# EasyEDA schematic 1-Schematic_passcipher.json

## Sheets
1 Sheet_1
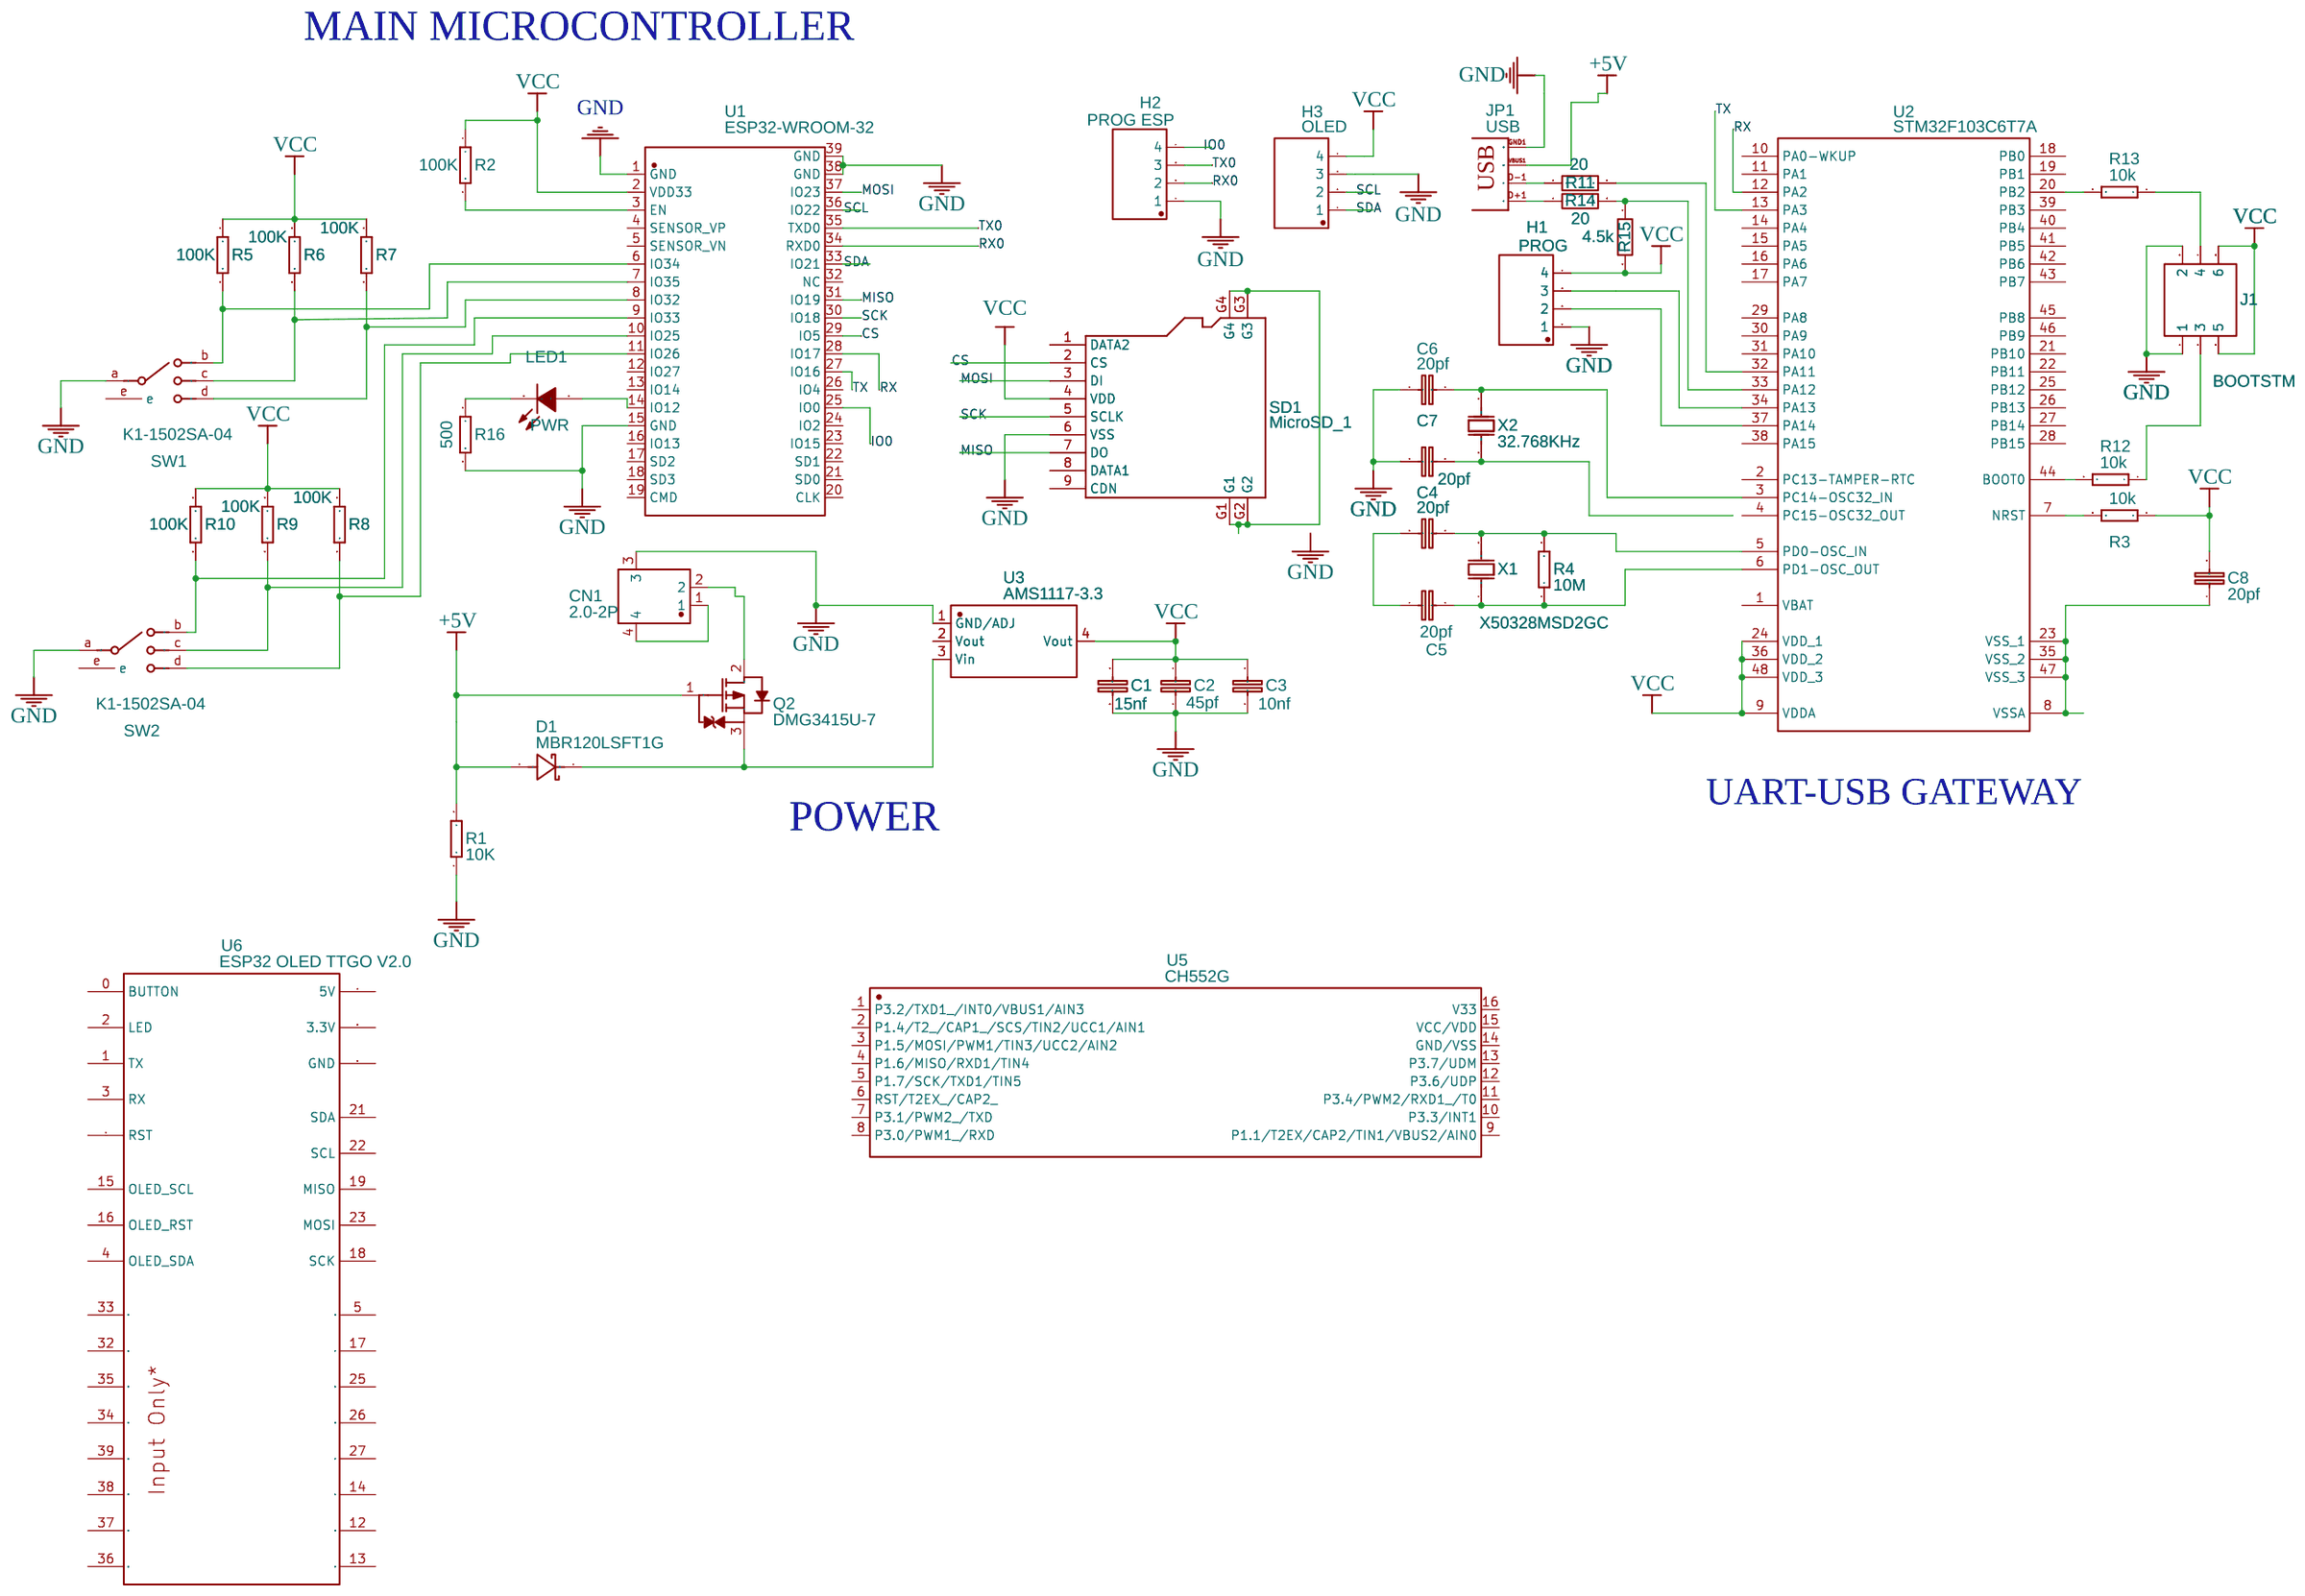
[diagram p0: Sheet_1]
2 expansionboard: TITLE: Sheet_3; REV: 1.0; Date: 2021-07-15; Sheet: 1/1; Drawn By: Taiwo Yusuf Hassan; Company: Your Company
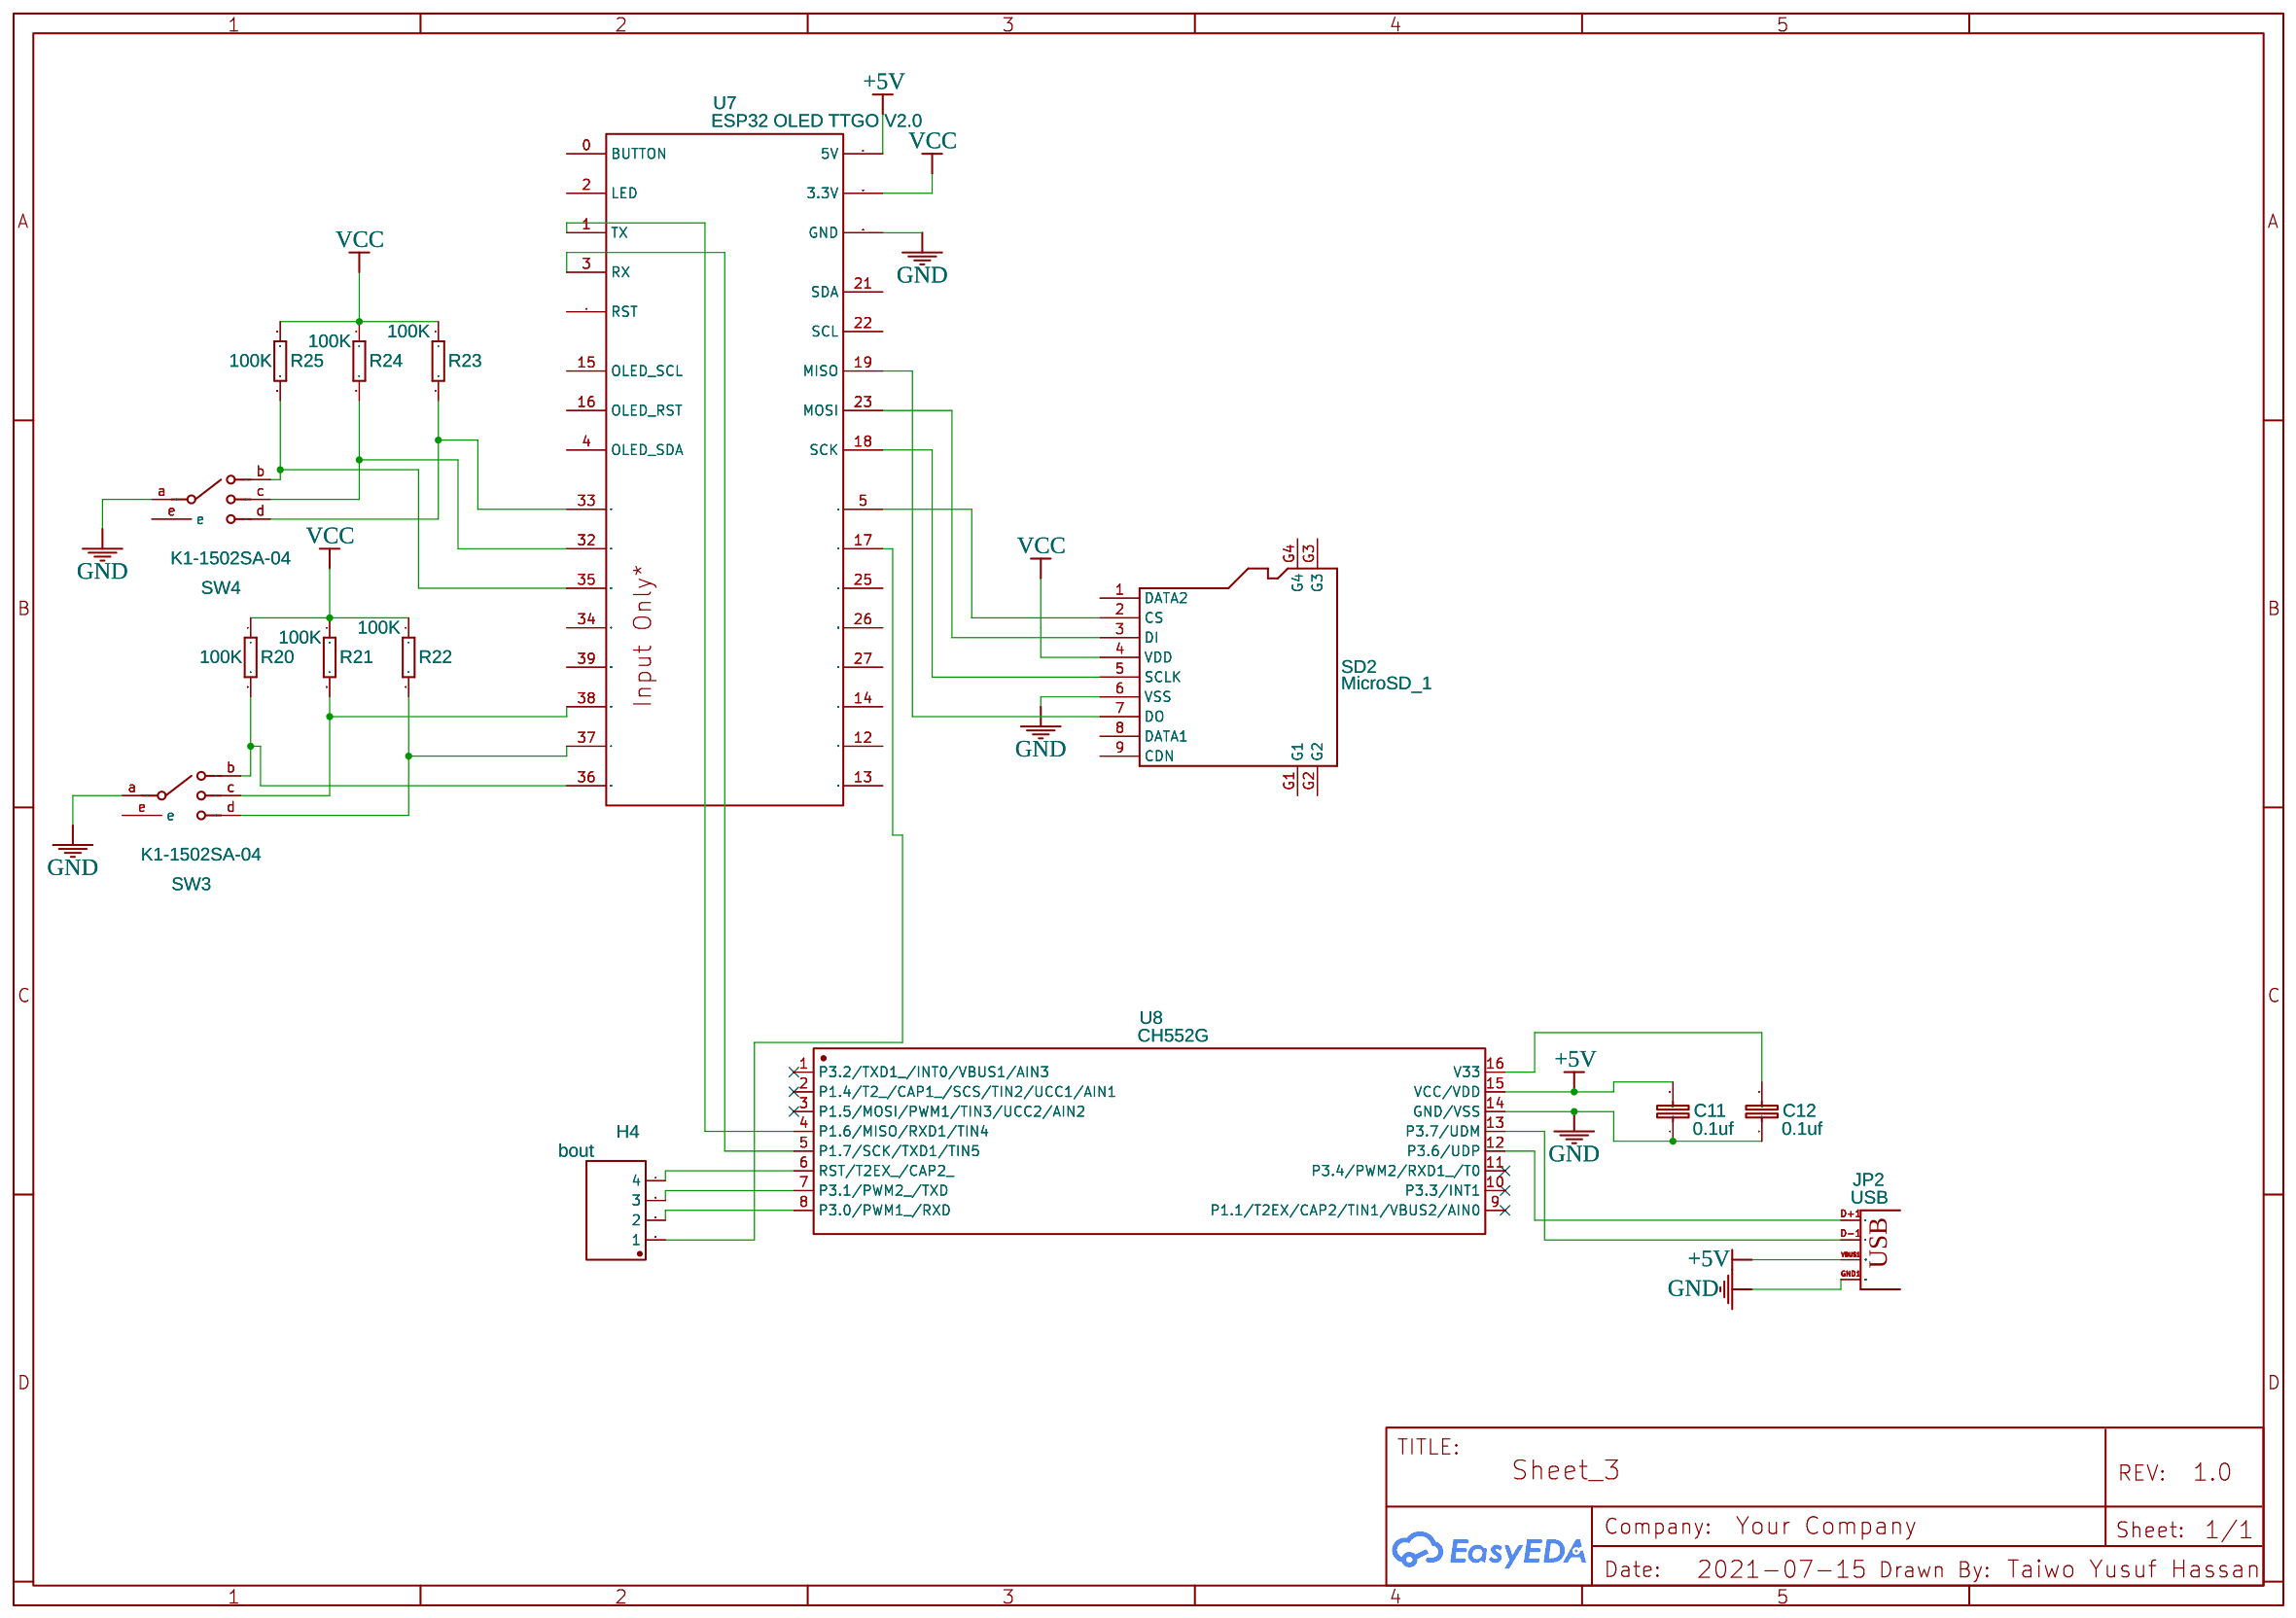
[diagram p1: expansionboard]

## Parts
sheet expansionboard
C11  0.1uf  [C603]
C12  0.1uf  [C603]
H4  bout  [HDR-TH_4P-P2.54-V]
JP2  USB  [USB-A-SMT-MALE]
R20  100K  [R805]
R21  100K  [R805]
R22  100K  [R805]
R23  100K  [R805]
R24  100K  [R805]
R25  100K  [R805]
SD2  MicroSD_1  [MICRO-SD9+4P-SMD-16.1X14.5X1.85MM]
SW3  K1-1502SA-04  [SW-SMD_K1-1502SA-04]
SW4  K1-1502SA-04  [SW-SMD_K1-1502SA-04]
U7  ESP32 OLED TTGO V2.0  [ESP32 OLED TTGO V2.0 PRO]
U8  CH552G  [SOP-16_L10.0-W3.9-P1.27-LS6.0-BL]
sheet Sheet_1
C1  15nf  [C603]
C2  45pf  [C603]
C3  10nf  [C603]
C4  20pf  [C603]
C5  20pf  [C603]
C6  20pf  [C603]
C7  20pf  [C603]
C8  20pf  [C603]
CN1  2.0-2P  [CONN-SMD_2.0-2P-LT]
D1  MBR120LSFT1G  [SOD-123_L2.8-W1.8-LS3.7-RD]
H1  PROG  [HDR-TH_4P-P2.54-V]
H2  PROG ESP  [HDR-TH_4P-P2.54-V]
H3  OLED  [HDR-TH_4P-P2.54-V]
J1  BOOTSTM  [HDR-TH_6P-P2.54-V-R2-C3-S2.54]
JP1  USB  [USB-A-SMT-MALE]
LED1  PWR  [LED0603-R-RD]
Q2  DMG3415U-7  [SOT-23-3_L2.9-W1.6-P1.90-LS2.8-BR-CW]
R1  10K  [R805]
R2  100K  [R805]
R3  10k  [R805]
R4  10M  [R805]
R5  100K  [R805]
R6  100K  [R805]
R7  100K  [R805]
R8  100K  [R805]
R9  100K  [R805]
R10  100K  [R805]
R11  20  [R0603]
R12  10k  [R805]
R13  10k  [R805]
R14  20  [R0603]
R15  4.5k  [R0603]
R16  500  [R805]
SD1  MicroSD_1  [MICRO-SD9+4P-SMD-16.1X14.5X1.85MM]
SW1  K1-1502SA-04  [SW-SMD_K1-1502SA-04]
SW2  K1-1502SA-04  [SW-SMD_K1-1502SA-04]
U1  ESP32-WROOM-32  [WIFIM-SMD_39P-L25.5-W18.0-P1.27]
U2  STM32F103C6T7A  [LQFP-48_L7.0-W7.0-P0.50-LS9.0-BL]
U3  AMS1117-3.3  [SOT-223-3_L6.5-W3.4-P2.30-LS7.0-BR]
U5  CH552G  [SOP-16_L10.0-W3.9-P1.27-LS6.0-BL]
U6  ESP32 OLED TTGO V2.0  [ESP32 OLED TTGO V2.0 PRO]
X1  X50328MSD2GC  [OSC-SMD_L5.0-W3.2]
X2  32.768KHz  [OSC-SMD_L2.0-W1.2]

## Library data of the parts
C1-C8 C11 C12 = CAPACITOR_NPOL: Contributor: DangerousPrototype
H1-H4 = Header-Male-2.54_1x4: Supplier: LCSC; Manufacturer: Ckmtw; Manufacturer Part: 210S-1*4P L=11.6MMGold-plated black; Contributor: LCSC; Supplier Part: C124378; JLCPCB Part Class: Extended Part
JP1 JP2 = USB: Contributor: SparkFun
R2 R4-R10 R16 R20-R25 = RESISTOR: Contributor: DangerousPrototype; Package Display: No
SD1 SD2 = MicroSD_1: Micro SD Card Holder;; Supplier Part: 320090008; Supplier: SeeedStudio; Manufacturer Part: ?; sourceId: 6RLFzRL3l
SW1-SW4 = K1-1502SA-04: Supplier: LCSC; Supplier Part: C145914; Manufacturer: Korean Hroparts Elec; Contributor: LCSC; JLCPCB Part Class: Extended Part
U6 U7 = ESP32 OLED TTGO V2.0: Manufacturer Part: ESP32 OLED TTGO V2.0 Pro; Contributor: Zba Lart; Supplier Part: 32822105291; Supplier: Ali-express; link: https://www.aliexpress.com/item/Lolin-ESP32-OLED-V2-0-Pro-ESP32-OLED-wemos-pour-Arduino-ESP32-OLED-WiFi-Modules-Bluetooth/32822105291.html
U5 U8 = CH552G: Supplier: LCSC; Manufacturer: WCH; Supplier Part: C111292; Paste Type: Extended Part; JLCPCB Part Class: Extended Part
CN1 = 2.0-2P: Supplier: LCSC; Supplier Part: C146053; Manufacturer: Boom Precision Elec; Contributor: LCSC; JLCPCB Part Class: Extended Part
D1 = MBR120LSFT1G: Supplier: LCSC; Supplier Part: C891416; Manufacturer: ON Semiconductor; Contributor: LCSC
J1 = Header-Male-2.54_2x3: Supplier: LCSC; Manufacturer: BOOMELE; Supplier Part: C65114; JLCPCB Part Class: Extended Part
LED1 = LTST-C193TGKT-5A: Supplier: LCSC; Manufacturer: LITEON; Supplier Part: C12065; JLCPCB Part Class: Extended Part
Q2 = DMG3415U-7: Supplier: LCSC; Supplier Part: C96616; Manufacturer: Diodes Incorporated; Contributor: LCSC; JLCPCB Part Class: Extended Part
R1 R3 R12 R13 = RESISTOR: Contributor: DangerousPrototype
R11 R14 R15 = RS-03K3242FT: Supplier: LCSC; Supplier Part: C304734; Manufacturer: Guangdong Fenghua Advanced Tech; Contributor: LCSC
U1 = ESP32-WROOM-32: Supplier: LCSC; Supplier Part: C503587; Manufacturer: Espressif Systems; Contributor: LCSC
U2 = STM32F103C6T7A: Supplier: LCSC; Supplier Part: C222074; Manufacturer: STMicroelectronics; Contributor: LCSC; JLCPCB Part Class: Extended Part
U3 = AMS1117-3.3: sourceId: dwIGgezVh; Supplier: LCSC; Manufacturer: AMS; Supplier Part: C6186; JLCPCB Part Class: Basic Part
X1 = X50328MSD2GC: Supplier Part: C18560; Supplier: LCSC; Manufacturer: YXC; JLCPCB Part Class: Extended Part
X2 = 9H0322LCSC-DZF2S: Supplier: LCSC; Manufacturer: TXC; Supplier Part: C90943

## Nets
+5V: C11.2 D1.2(A) JP1.VBUS1(VBUS) JP2.VBUS1(VBUS) Q2.1(G) R1.2 U7.41(5V) U8.15(VCC/VDD)
GND: C1.2 C2.2 C3.2 C6.1 C7.1 C11.1 C12.1 CN1.3 H1.1 H2.1 H3.3 J1.1 J1.2 JP1.GND1(GND) JP2.GND1(GND) R1.1 R16.2 SD1.6(VSS) SD2.6(VSS) SW1.a SW2.a SW3.a SW4.a U1.1(GND) U1.15(GND) U1.38(GND) U1.39(GND) U3.1(GND/ADJ) U7.40(GND) U8.14(GND/VSS)
VCC: C1.1 C2.1 C3.1 C8.2 H1.4 H3.4 J1.5 J1.6 R2.1 R3.1 R5.1 R6.1 R7.1 R8.1 R9.1 R10.1 R15.2 R20.1 R21.1 R22.1 R23.1 R24.1 R25.1 SD1.4(VDD) SD2.4(VDD) U1.2(VDD33) U2.9(VDDA) U2.24(VDD_1) U2.36(VDD_2) U2.48(VDD_3) U3.4(Vout) U7.42(3.3V)
CS: SD1.2(CS) U1.29(IO5)
IO0: H2.4 U1.25(IO0)
MISO: SD1.7(DO) U1.31(IO19)
MOSI: SD1.3(DI) U1.37(IO23)
RX: U1.28(IO17) U2.12(PA2)
RX0: H2.2 U1.34(RXD0)
SCK: SD1.5(SCLK) U1.30(IO18)
SCL: H3.2 U1.36(IO22)
SDA: H3.1 U1.33(IO21)
TX: U1.27(IO16) U2.13(PA3)
TX0: H2.3 U1.35(TXD0)
Net-(C4-1): C4.1 C5.1
Net-(C4-2): C4.2 R4.2 U2.5(PD0-OSC_IN) X1.2(OSC2)
Net-(C5-2): C5.2 R4.1 U2.6(PD1-OSC_OUT) X1.1(OSC1)
Net-(C6-2): C6.2 U2.3(PC14-OSC32_IN) X2.1(OSC1)
Net-(C7-2): C7.2 X2.2(OSC2)
Net-(C8-1): C8.1 U2.8(VSSA) U2.23(VSS_1) U2.35(VSS_2) U2.47(VSS_3)
Net-(C12-2): C12.2 U8.16(V33)
Net-(CN1-1): CN1.1 CN1.4
Net-(CN1-2): CN1.2 Q2.2(D)
Net-(D1-1): D1.1(C) Q2.3(S) U3.3(Vin)
Net-(H1-2): H1.2 U2.37(PA14)
Net-(H1-3): H1.3 U2.34(PA13)
Net-(H4-1): H4.1 U7.17
Net-(H4-2): H4.2 U8.8(P3.0/PWM1_/RXD)
Net-(H4-3): H4.3 U8.7(P3.1/PWM2_/TXD)
Net-(H4-4): H4.4 U8.6(RST/T2EX_/CAP2_)
Net-(J1-3): J1.3 R12.1
Net-(J1-4): J1.4 R13.1
Net-(JP1-D+1): JP1.D+1(D+) R14.1
Net-(JP1-D-1): JP1.D-1(D-) R11.1
Net-(JP2-D+1): JP2.D+1(D+) U8.12(P3.6/UDP)
Net-(JP2-D-1): JP2.D-1(D-) U8.13(P3.7/UDM)
Net-(LED1-1): LED1.1(A) U1.14(IO12)
Net-(LED1-2): LED1.2(K) R16.1
Net-(R2-2): R2.2 U1.3(EN)
Net-(R3-2): R3.2 U2.7(NRST)
Net-(R5-2): R5.2 SW1.b U1.6(IO34)
Net-(R6-2): R6.2 SW1.c U1.7(IO35)
Net-(R7-2): R7.2 SW1.d U1.8(IO32)
Net-(R8-2): R8.2 SW2.d U1.11(IO26)
Net-(R9-2): R9.2 SW2.c U1.10(IO25)
Net-(R10-2): R10.2 SW2.b U1.9(IO33)
Net-(R11-2): R11.2 U2.32(PA11)
Net-(R12-2): R12.2 U2.44(BOOT0)
Net-(R13-2): R13.2 U2.20(PB2)
Net-(R14-2): R14.2 R15.1 U2.33(PA12)
Net-(R20-2): R20.2 SW3.b U7.36
Net-(R21-2): R21.2 SW3.c U7.38
Net-(R22-2): R22.2 SW3.d U7.37
Net-(R23-2): R23.2 SW4.d U7.33
Net-(R24-2): R24.2 SW4.c U7.32
Net-(R25-2): R25.2 SW4.b U7.35
Net-(SD1-G1): SD1.G1 SD1.G2 SD1.G3 SD1.G4
Net-(SD2-2): SD2.2(CS) U7.5
Net-(SD2-3): SD2.3(DI) U7.23(MOSI)
Net-(SD2-5): SD2.5(SCLK) U7.18(SCK)
Net-(SD2-7): SD2.7(DO) U7.19(MISO)
Net-(U7-1): U7.1(TX) U8.4(P1.6/MISO/RXD1/TIN4)
Net-(U7-3): U7.3(RX) U8.5(P1.7/SCK/TXD1/TIN5)

Not connected (* = marked no-connect by the designer): SD1 1(DATA2) 8(DATA1) 9(CDN); SD2 1(DATA2) 8(DATA1) 9(CDN) G1 G2 G3 G4; SW1 e; SW2 e; SW3 e; SW4 e; U1 4(SENSOR_VP) 5(SENSOR_VN) 12(IO27) 13(IO14) 16(IO13) 17(SD2) 18(SD3) 19(CMD) 20(CLK) 21(SD0) 22(SD1) 23(IO15) 24(IO2) 26(IO4) 32(NC); U2 1(VBAT) 2(PC13-TAMPER-RTC) 4(PC15-OSC32_OUT) 10(PA0-WKUP) 11(PA1) 14(PA4) 15(PA5) 16(PA6) 17(PA7) 18(PB0) 19(PB1) 21(PB10) 22(PB11) 25(PB12) 26(PB13) 27(PB14) 28(PB15) 29(PA8) 30(PA9) 31(PA10) 38(PA15) 39(PB3) 40(PB4) 41(PB5) 42(PB6) 43(PB7) 45(PB8) 46(PB9); U3 2(Vout); U5 1(P3.2/TXD1_/INT0/VBUS1/AIN3) 2(P1.4/T2_/CAP1_/SCS/TIN2/UCC1/AIN1) 3(P1.5/MOSI/PWM1/TIN3/UCC2/AIN2) 4(P1.6/MISO/RXD1/TIN4) 5(P1.7/SCK/TXD1/TIN5) 6(RST/T2EX_/CAP2_) 7(P3.1/PWM2_/TXD) 8(P3.0/PWM1_/RXD) 9(P1.1/T2EX/CAP2/TIN1/VBUS2/AIN0) 10(P3.3/INT1) 11(P3.4/PWM2/RXD1_/T0) 12(P3.6/UDP) 13(P3.7/UDM) 14(GND/VSS) 15(VCC/VDD) 16(V33); U6 0(BUTTON) 1(TX) 2(LED) 3(RX) 4(OLED_SDA) 5 12 13 14 15(OLED_SCL) 16(OLED_RST) 17 18(SCK) 19(MISO) 21(SDA) 22(SCL) 23(MOSI) 25 26 27 32 33 34 35 36 37 38 39(39*) 40(GND) 41(5V) 42(3.3V) 44(RST); U7 0(BUTTON) 2(LED) 4(OLED_SDA) 12 13 14 15(OLED_SCL) 16(OLED_RST) 21(SDA) 22(SCL) 25 26 27 34 39(39*) 44(RST); U8 1(P3.2/TXD1_/INT0/VBUS1/AIN3)* 2(P1.4/T2_/CAP1_/SCS/TIN2/UCC1/AIN1)* 3(P1.5/MOSI/PWM1/TIN3/UCC2/AIN2)* 9(P1.1/T2EX/CAP2/TIN1/VBUS2/AIN0)* 10(P3.3/INT1)* 11(P3.4/PWM2/RXD1_/T0)*

## Notes on the sheets
sheet 1
- MAIN MICROCONTROLLER
- UART-USB GATEWAY
- POWER
